# EAGLE design proto (EAGLE 9.6.2)
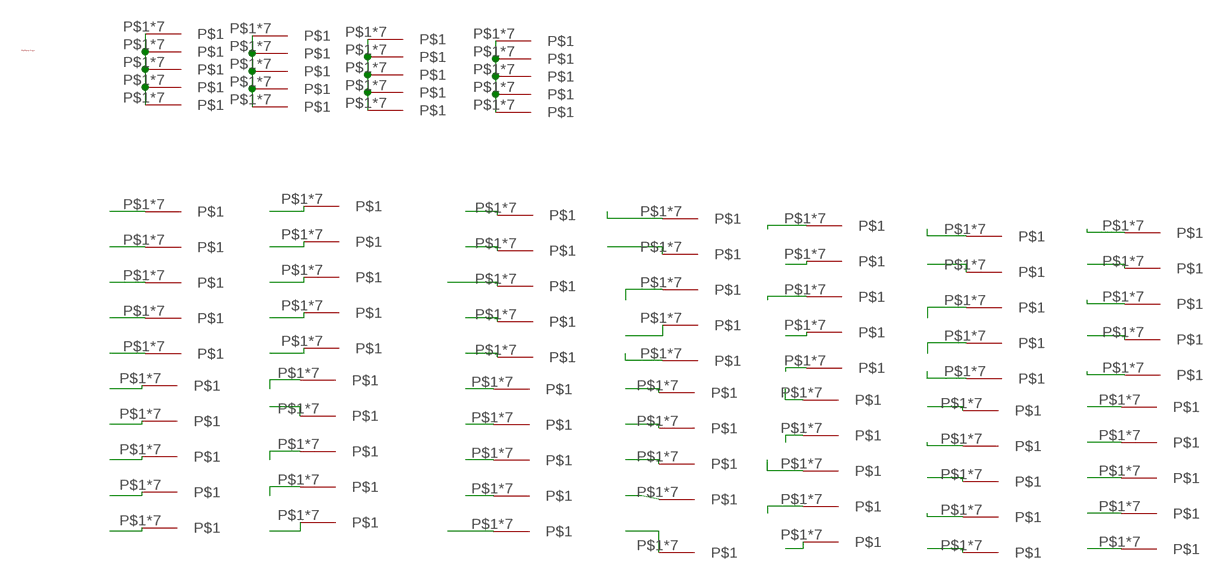
[diagram p0: schematic, sheet 1]

## Parts
U$1  LOGO_HACKHEIM  [LOGO_HACKHEIM]
U$4  PROTO_PAD  [PROTO_PAD]
U$5  PROTO_PAD  [PROTO_PAD]
U$6  PROTO_PAD  [PROTO_PAD]
U$7  PROTO_PAD  [PROTO_PAD]
U$8  PROTO_PAD  [PROTO_PAD]
U$9  PROTO_PAD  [PROTO_PAD]
U$10  PROTO_PAD  [PROTO_PAD]
U$11  PROTO_PAD  [PROTO_PAD]
U$12  PROTO_PAD  [PROTO_PAD]
U$13  PROTO_PAD  [PROTO_PAD]
U$14  PROTO_PAD  [PROTO_PAD]
U$15  PROTO_PAD  [PROTO_PAD]
U$16  PROTO_PAD  [PROTO_PAD]
U$17  PROTO_PAD  [PROTO_PAD]
U$18  PROTO_PAD  [PROTO_PAD]
U$19  PROTO_PAD  [PROTO_PAD]
U$20  PROTO_PAD  [PROTO_PAD]
U$21  PROTO_PAD  [PROTO_PAD]
U$22  PROTO_PAD  [PROTO_PAD]
U$23  PROTO_PAD  [PROTO_PAD]
U$24  PROTO_PAD  [PROTO_PAD]
U$25  PROTO_PAD  [PROTO_PAD]
U$26  PROTO_PAD  [PROTO_PAD]
U$27  PROTO_PAD  [PROTO_PAD]
U$28  PROTO_PAD  [PROTO_PAD]
U$29  PROTO_PAD  [PROTO_PAD]
U$30  PROTO_PAD  [PROTO_PAD]
U$31  PROTO_PAD  [PROTO_PAD]
U$32  PROTO_PAD  [PROTO_PAD]
U$33  PROTO_PAD  [PROTO_PAD]
U$34  PROTO_PAD  [PROTO_PAD]
U$35  PROTO_PAD  [PROTO_PAD]
U$36  PROTO_PAD  [PROTO_PAD]
U$37  PROTO_PAD  [PROTO_PAD]
U$38  PROTO_PAD  [PROTO_PAD]
U$39  PROTO_PAD  [PROTO_PAD]
U$40  PROTO_PAD  [PROTO_PAD]
U$41  PROTO_PAD  [PROTO_PAD]
U$42  PROTO_PAD  [PROTO_PAD]
U$43  PROTO_PAD  [PROTO_PAD]
U$44  PROTO_PAD  [PROTO_PAD]
U$45  PROTO_PAD  [PROTO_PAD]
U$46  PROTO_PAD  [PROTO_PAD]
U$47  PROTO_PAD  [PROTO_PAD]
U$48  PROTO_PAD  [PROTO_PAD]
U$49  PROTO_PAD  [PROTO_PAD]
U$50  PROTO_PAD  [PROTO_PAD]
U$51  PROTO_PAD  [PROTO_PAD]
U$52  PROTO_PAD  [PROTO_PAD]
U$53  PROTO_PAD  [PROTO_PAD]
U$54  PROTO_PAD  [PROTO_PAD]
U$55  PROTO_PAD  [PROTO_PAD]
U$56  PROTO_PAD  [PROTO_PAD]
U$57  PROTO_PAD  [PROTO_PAD]
U$58  PROTO_PAD  [PROTO_PAD]
U$59  PROTO_PAD  [PROTO_PAD]
U$60  PROTO_PAD  [PROTO_PAD]
U$61  PROTO_PAD  [PROTO_PAD]
U$62  PROTO_PAD  [PROTO_PAD]
U$63  PROTO_PAD  [PROTO_PAD]
U$64  PROTO_PAD  [PROTO_PAD]
U$65  PROTO_PAD  [PROTO_PAD]
U$66  PROTO_PAD  [PROTO_PAD]
U$67  PROTO_PAD  [PROTO_PAD]
U$68  PROTO_PAD  [PROTO_PAD]
U$69  PROTO_PAD  [PROTO_PAD]
U$70  PROTO_PAD  [PROTO_PAD]
U$71  PROTO_PAD  [PROTO_PAD]
U$72  PROTO_PAD  [PROTO_PAD]
U$73  PROTO_PAD  [PROTO_PAD]
U$74  PROTO_PAD  [PROTO_PAD]
U$75  PROTO_PAD  [PROTO_PAD]
U$76  PROTO_PAD  [PROTO_PAD]
U$77  PROTO_PAD  [PROTO_PAD]
U$78  PROTO_PAD  [PROTO_PAD]
U$79  PROTO_PAD  [PROTO_PAD]
U$80  PROTO_PAD  [PROTO_PAD]
U$81  PROTO_PAD  [PROTO_PAD]
U$82  PROTO_PAD  [PROTO_PAD]
U$83  PROTO_PAD  [PROTO_PAD]
U$84  PROTO_PAD  [PROTO_PAD]
U$85  PROTO_PAD  [PROTO_PAD]
U$86  PROTO_PAD  [PROTO_PAD]
U$87  PROTO_PAD  [PROTO_PAD]
U$88  PROTO_PAD  [PROTO_PAD]
U$89  PROTO_PAD  [PROTO_PAD]
U$90  PROTO_PAD  [PROTO_PAD]
U$91  PROTO_PAD  [PROTO_PAD]
U$92  PROTO_PAD  [PROTO_PAD]
U$93  PROTO_PAD  [PROTO_PAD]

## Nets
N$1: U$4.P$1 U$4.P$2 U$4.P$3 U$4.P$4 U$4.P$5 U$4.P$6 U$4.P$7 U$5.P$1 U$5.P$2 U$5.P$3 U$5.P$4 U$5.P$5 U$5.P$6 U$5.P$7 U$6.P$1 U$6.P$2 U$6.P$3 U$6.P$4 U$6.P$5 U$6.P$6 U$6.P$7 U$7.P$1 U$7.P$2 U$7.P$3 U$7.P$4 U$7.P$5 U$7.P$6 U$7.P$7 U$8.P$1 U$8.P$2 U$8.P$3 U$8.P$4 U$8.P$5 U$8.P$6 U$8.P$7
N$2: U$9.P$1 U$9.P$2 U$9.P$3 U$9.P$4 U$9.P$5 U$9.P$6 U$9.P$7 U$10.P$1 U$10.P$2 U$10.P$3 U$10.P$4 U$10.P$5 U$10.P$6 U$10.P$7 U$11.P$1 U$11.P$2 U$11.P$3 U$11.P$4 U$11.P$5 U$11.P$6 U$11.P$7 U$12.P$1 U$12.P$2 U$12.P$3 U$12.P$4 U$12.P$5 U$12.P$6 U$12.P$7 U$13.P$1 U$13.P$2 U$13.P$3 U$13.P$4 U$13.P$5 U$13.P$6 U$13.P$7
N$3: U$14.P$1 U$14.P$2 U$14.P$3 U$14.P$4 U$14.P$5 U$14.P$6 U$14.P$7
N$4: U$15.P$1 U$15.P$2 U$15.P$3 U$15.P$4 U$15.P$5 U$15.P$6 U$15.P$7
N$5: U$24.P$1 U$24.P$2 U$24.P$3 U$24.P$4 U$24.P$5 U$24.P$6 U$24.P$7 U$25.P$1 U$25.P$2 U$25.P$3 U$25.P$4 U$25.P$5 U$25.P$6 U$25.P$7 U$26.P$1 U$26.P$2 U$26.P$3 U$26.P$4 U$26.P$5 U$26.P$6 U$26.P$7 U$27.P$1 U$27.P$2 U$27.P$3 U$27.P$4 U$27.P$5 U$27.P$6 U$27.P$7 U$28.P$1 U$28.P$2 U$28.P$3 U$28.P$4 U$28.P$5 U$28.P$6 U$28.P$7
N$6: U$29.P$1 U$29.P$2 U$29.P$3 U$29.P$4 U$29.P$5 U$29.P$6 U$29.P$7 U$30.P$1 U$30.P$2 U$30.P$3 U$30.P$4 U$30.P$5 U$30.P$6 U$30.P$7 U$31.P$1 U$31.P$2 U$31.P$3 U$31.P$4 U$31.P$5 U$31.P$6 U$31.P$7 U$32.P$1 U$32.P$2 U$32.P$3 U$32.P$4 U$32.P$5 U$32.P$6 U$32.P$7 U$33.P$1 U$33.P$2 U$33.P$3 U$33.P$4 U$33.P$5 U$33.P$6 U$33.P$7
N$7: U$16.P$1 U$16.P$2 U$16.P$3 U$16.P$4 U$16.P$5 U$16.P$6 U$16.P$7
N$8: U$17.P$1 U$17.P$2 U$17.P$3 U$17.P$4 U$17.P$5 U$17.P$6 U$17.P$7
N$9: U$18.P$1 U$18.P$2 U$18.P$3 U$18.P$4 U$18.P$5 U$18.P$6 U$18.P$7
N$10: U$44.P$1 U$44.P$2 U$44.P$3 U$44.P$4 U$44.P$5 U$44.P$6 U$44.P$7
N$11: U$45.P$1 U$45.P$2 U$45.P$3 U$45.P$4 U$45.P$5 U$45.P$6 U$45.P$7
N$12: U$46.P$1 U$46.P$2 U$46.P$3 U$46.P$4 U$46.P$5 U$46.P$6 U$46.P$7
N$13: U$47.P$1 U$47.P$2 U$47.P$3 U$47.P$4 U$47.P$5 U$47.P$6 U$47.P$7
N$14: U$48.P$1 U$48.P$2 U$48.P$3 U$48.P$4 U$48.P$5 U$48.P$6 U$48.P$7
N$15: U$19.P$1 U$19.P$2 U$19.P$3 U$19.P$4 U$19.P$5 U$19.P$6 U$19.P$7
N$16: U$20.P$1 U$20.P$2 U$20.P$3 U$20.P$4 U$20.P$5 U$20.P$6 U$20.P$7
N$17: U$21.P$1 U$21.P$2 U$21.P$3 U$21.P$4 U$21.P$5 U$21.P$6 U$21.P$7
N$18: U$22.P$1 U$22.P$2 U$22.P$3 U$22.P$4 U$22.P$5 U$22.P$6 U$22.P$7
N$19: U$23.P$1 U$23.P$2 U$23.P$3 U$23.P$4 U$23.P$5 U$23.P$6 U$23.P$7
N$20: U$49.P$1 U$49.P$2 U$49.P$3 U$49.P$4 U$49.P$5 U$49.P$6 U$49.P$7
N$21: U$50.P$1 U$50.P$2 U$50.P$3 U$50.P$4 U$50.P$5 U$50.P$6 U$50.P$7
N$22: U$51.P$1 U$51.P$2 U$51.P$3 U$51.P$4 U$51.P$5 U$51.P$6 U$51.P$7
N$23: U$52.P$1 U$52.P$2 U$52.P$3 U$52.P$4 U$52.P$5 U$52.P$6 U$52.P$7
N$24: U$34.P$1 U$34.P$2 U$34.P$3 U$34.P$4 U$34.P$5 U$34.P$6 U$34.P$7
N$25: U$35.P$1 U$35.P$2 U$35.P$3 U$35.P$4 U$35.P$5 U$35.P$6 U$35.P$7
N$26: U$36.P$1 U$36.P$2 U$36.P$3 U$36.P$4 U$36.P$5 U$36.P$6 U$36.P$7
N$27: U$37.P$1 U$37.P$2 U$37.P$3 U$37.P$4 U$37.P$5 U$37.P$6 U$37.P$7
N$28: U$38.P$1 U$38.P$2 U$38.P$3 U$38.P$4 U$38.P$5 U$38.P$6 U$38.P$7
N$29: U$54.P$1 U$54.P$2 U$54.P$3 U$54.P$4 U$54.P$5 U$54.P$6 U$54.P$7
N$30: U$55.P$1 U$55.P$2 U$55.P$3 U$55.P$4 U$55.P$5 U$55.P$6 U$55.P$7
N$31: U$56.P$1 U$56.P$2 U$56.P$3 U$56.P$4 U$56.P$5 U$56.P$6 U$56.P$7
N$32: U$57.P$1 U$57.P$2 U$57.P$3 U$57.P$4 U$57.P$5 U$57.P$6 U$57.P$7
N$33: U$58.P$1 U$58.P$2 U$58.P$3 U$58.P$4 U$58.P$5 U$58.P$6 U$58.P$7
N$34: U$39.P$1 U$39.P$2 U$39.P$3 U$39.P$4 U$39.P$5 U$39.P$6 U$39.P$7
N$35: U$40.P$1 U$40.P$2 U$40.P$3 U$40.P$4 U$40.P$5 U$40.P$6 U$40.P$7
N$36: U$41.P$1 U$41.P$2 U$41.P$3 U$41.P$4 U$41.P$5 U$41.P$6 U$41.P$7
N$37: U$42.P$1 U$42.P$2 U$42.P$3 U$42.P$4 U$42.P$5 U$42.P$6 U$42.P$7
N$38: U$43.P$1 U$43.P$2 U$43.P$3 U$43.P$4 U$43.P$5 U$43.P$6 U$43.P$7
N$39: U$59.P$1 U$59.P$2 U$59.P$3 U$59.P$4 U$59.P$5 U$59.P$6 U$59.P$7
N$40: U$60.P$1 U$60.P$2 U$60.P$3 U$60.P$4 U$60.P$5 U$60.P$6 U$60.P$7
N$41: U$61.P$1 U$61.P$2 U$61.P$3 U$61.P$4 U$61.P$5 U$61.P$6 U$61.P$7
N$42: U$62.P$1 U$62.P$2 U$62.P$3 U$62.P$4 U$62.P$5 U$62.P$6 U$62.P$7
N$43: U$63.P$1 U$63.P$2 U$63.P$3 U$63.P$4 U$63.P$5 U$63.P$6 U$63.P$7
N$44: U$64.P$1 U$64.P$2 U$64.P$3 U$64.P$4 U$64.P$5 U$64.P$6 U$64.P$7
N$45: U$65.P$1 U$65.P$2 U$65.P$3 U$65.P$4 U$65.P$5 U$65.P$6 U$65.P$7
N$46: U$66.P$1 U$66.P$2 U$66.P$3 U$66.P$4 U$66.P$5 U$66.P$6 U$66.P$7
N$47: U$67.P$1 U$67.P$2 U$67.P$3 U$67.P$4 U$67.P$5 U$67.P$6 U$67.P$7
N$48: U$68.P$1 U$68.P$2 U$68.P$3 U$68.P$4 U$68.P$5 U$68.P$6 U$68.P$7
N$49: U$69.P$1 U$69.P$2 U$69.P$3 U$69.P$4 U$69.P$5 U$69.P$6 U$69.P$7
N$50: U$70.P$1 U$70.P$2 U$70.P$3 U$70.P$4 U$70.P$5 U$70.P$6 U$70.P$7
N$51: U$71.P$1 U$71.P$2 U$71.P$3 U$71.P$4 U$71.P$5 U$71.P$6 U$71.P$7
N$52: U$72.P$1 U$72.P$2 U$72.P$3 U$72.P$4 U$72.P$5 U$72.P$6 U$72.P$7
N$53: U$73.P$1 U$73.P$2 U$73.P$3 U$73.P$4 U$73.P$5 U$73.P$6 U$73.P$7
N$54: U$74.P$1 U$74.P$2 U$74.P$3 U$74.P$4 U$74.P$5 U$74.P$6 U$74.P$7
N$55: U$75.P$1 U$75.P$2 U$75.P$3 U$75.P$4 U$75.P$5 U$75.P$6 U$75.P$7
N$56: U$76.P$1 U$76.P$2 U$76.P$3 U$76.P$4 U$76.P$5 U$76.P$6 U$76.P$7
N$57: U$77.P$1 U$77.P$2 U$77.P$3 U$77.P$4 U$77.P$5 U$77.P$6 U$77.P$7
N$58: U$78.P$1 U$78.P$2 U$78.P$3 U$78.P$4 U$78.P$5 U$78.P$6 U$78.P$7
N$59: U$79.P$1 U$79.P$2 U$79.P$3 U$79.P$4 U$79.P$5 U$79.P$6 U$79.P$7
N$60: U$80.P$1 U$80.P$2 U$80.P$3 U$80.P$4 U$80.P$5 U$80.P$6 U$80.P$7
N$61: U$81.P$1 U$81.P$2 U$81.P$3 U$81.P$4 U$81.P$5 U$81.P$6 U$81.P$7
N$62: U$82.P$1 U$82.P$2 U$82.P$3 U$82.P$4 U$82.P$5 U$82.P$6 U$82.P$7
N$63: U$83.P$1 U$83.P$2 U$83.P$3 U$83.P$4 U$83.P$5 U$83.P$6 U$83.P$7
N$64: U$84.P$1 U$84.P$2 U$84.P$3 U$84.P$4 U$84.P$5 U$84.P$6 U$84.P$7
N$65: U$85.P$1 U$85.P$2 U$85.P$3 U$85.P$4 U$85.P$5 U$85.P$6 U$85.P$7
N$66: U$86.P$1 U$86.P$2 U$86.P$3 U$86.P$4 U$86.P$5 U$86.P$6 U$86.P$7
N$67: U$87.P$1 U$87.P$2 U$87.P$3 U$87.P$4 U$87.P$5 U$87.P$6 U$87.P$7
N$68: U$88.P$1 U$88.P$2 U$88.P$3 U$88.P$4 U$88.P$5 U$88.P$6 U$88.P$7
N$69: U$89.P$1 U$89.P$2 U$89.P$3 U$89.P$4 U$89.P$5 U$89.P$6 U$89.P$7
N$70: U$90.P$1 U$90.P$2 U$90.P$3 U$90.P$4 U$90.P$5 U$90.P$6 U$90.P$7
N$71: U$91.P$1 U$91.P$2 U$91.P$3 U$91.P$4 U$91.P$5 U$91.P$6 U$91.P$7
N$72: U$92.P$1 U$92.P$2 U$92.P$3 U$92.P$4 U$92.P$5 U$92.P$6 U$92.P$7
N$73: U$93.P$1 U$93.P$2 U$93.P$3 U$93.P$4 U$93.P$5 U$93.P$6 U$93.P$7
N$74: U$53.P$1 U$53.P$2 U$53.P$3 U$53.P$4 U$53.P$5 U$53.P$6 U$53.P$7

## Library data of the parts
U$1 = TimeExpander2:LOGO_HACKHEIM
U$4-U$93 = TimeExpander2:PROTO_PAD

## Board
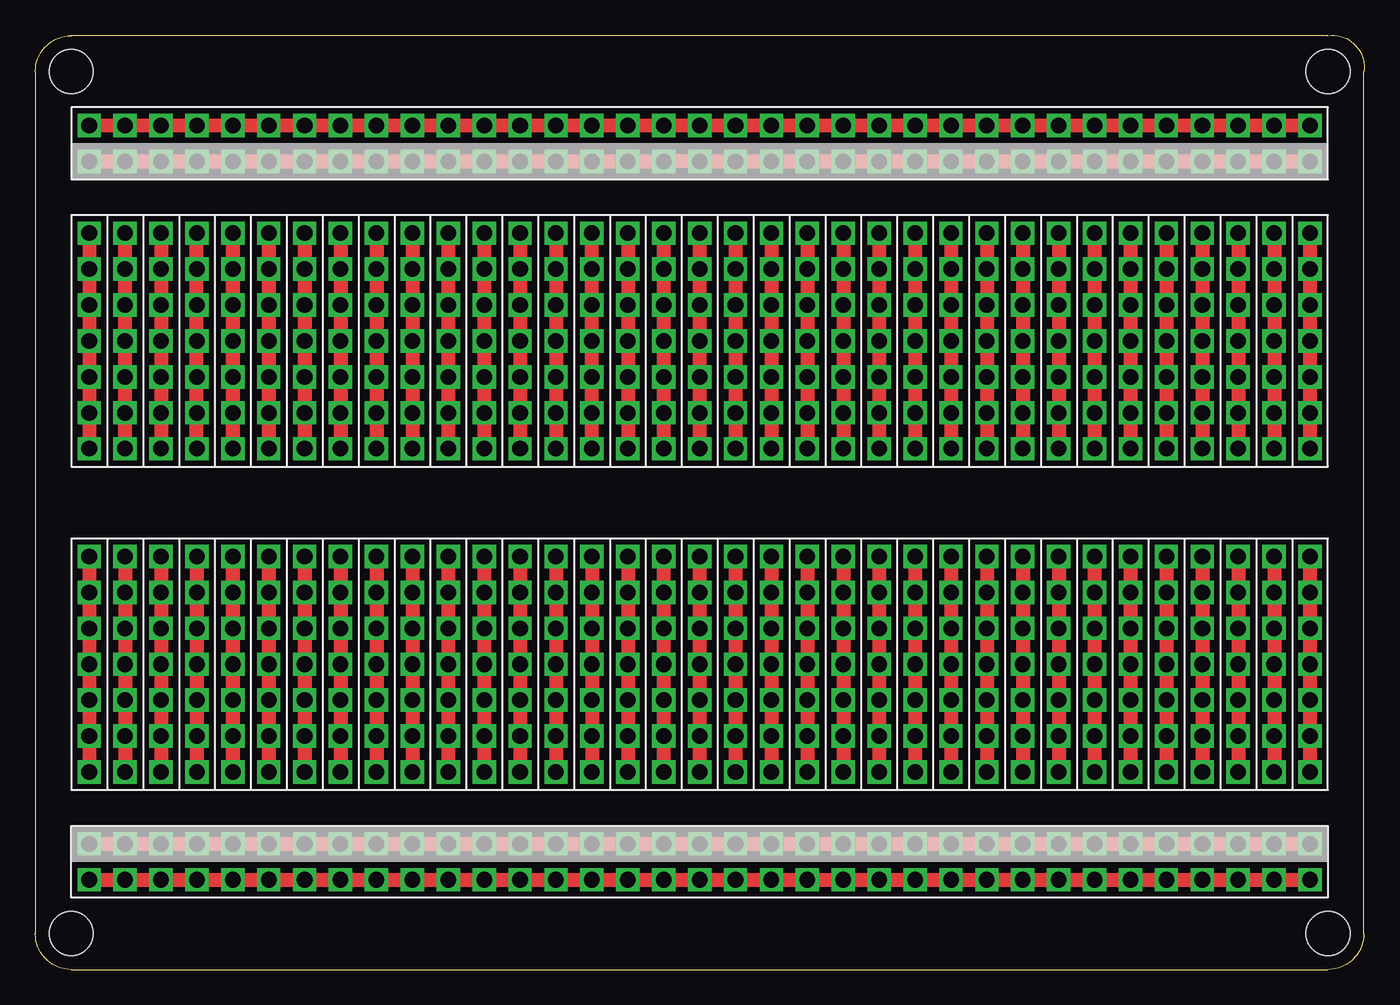
[diagram p1: board, top side]
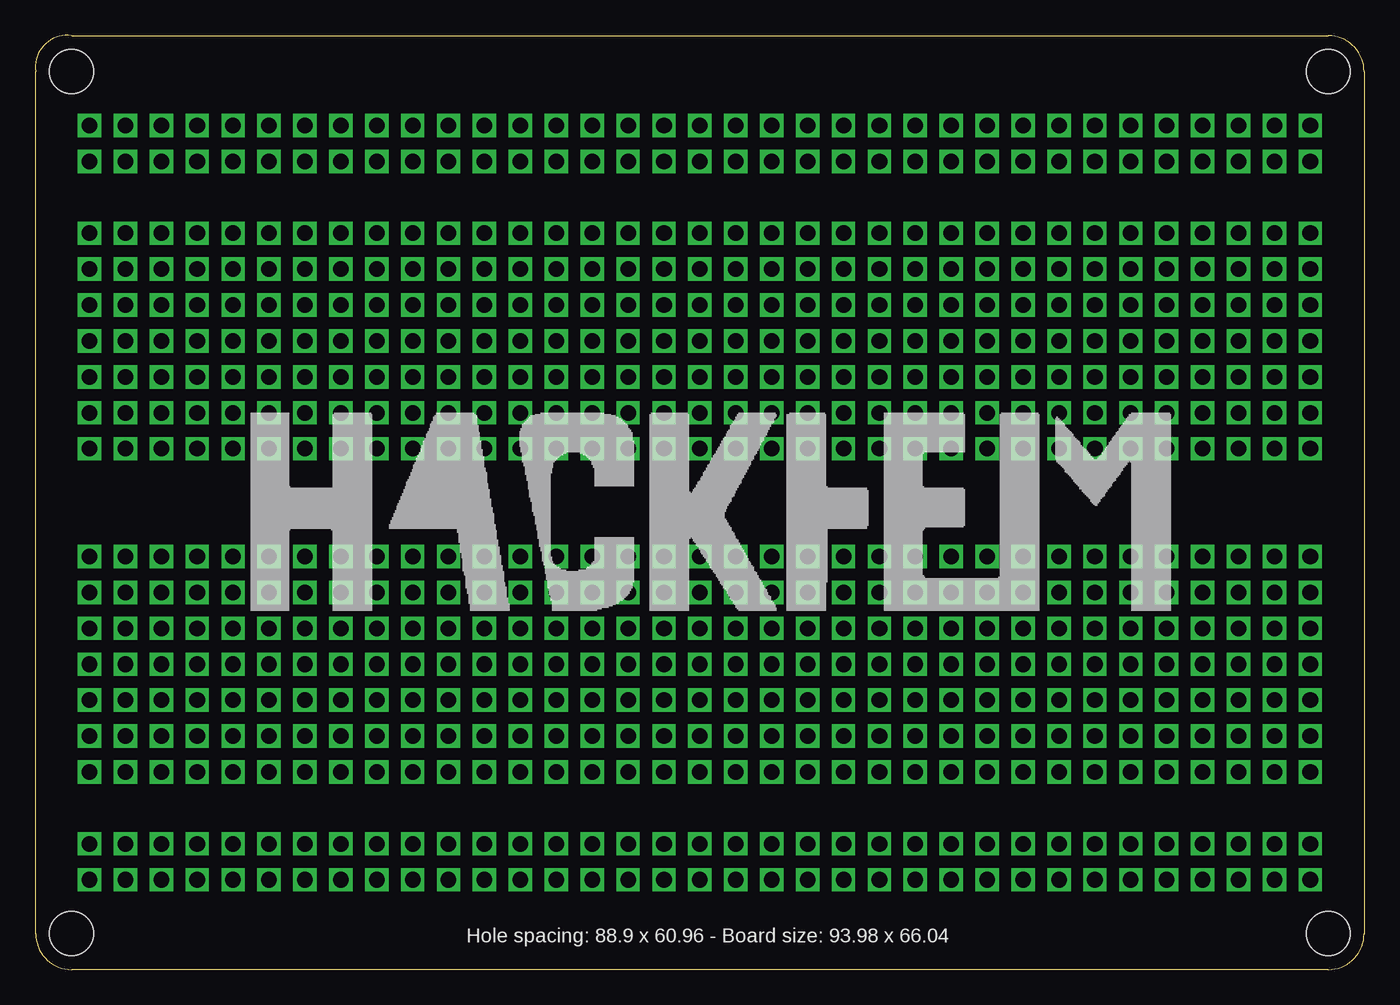
[diagram p2: board, bottom side, seen from below]

Size 94 x 66.06 mm. Coordinates in mm from the lower left corner, seen from the top.
Outline: 2.54,0 91.44,0 arc90 93.98,2.54 93.98,63.5 arc106 91.44,66.04 2.54,66.04 arc90 0,63.5 0,2.54 arc90 2.54,0
Copper layers (1*16): Top 0.035mm / dielectric 1.5mm / Bottom 0.035mm
Design rules "default": minimum track width 6mil, minimum drill 0.35mm, track to track 6mil, track to pad 6mil, pad to pad 6mil, via to via 6mil, smd to smd 6mil, copper to edge 40mil, drill to drill 6mil, minimum pad ring 10mil, minimum via ring 8mil, stop-mask expansion 4mil, vias tented up to drill 0mil, thermal gap 10mil
Holes 3.1 mm at 2.54,63.5 91.44,63.5 91.44,2.54 2.54,2.54

### Footprints (pad centres in the part's own frame; a part is rotated, then mirrored left to right if it is on the bottom)
PROTO_PAD = drill 1.1 square: P$1 0,0; P$2 2.54,0; P$3 5.08,0; P$4 7.62,0; P$5 10.16,0; P$6 12.7,0; P$7 15.24,0

### Placement (x,y rotation side)
U$1  80.01,24.13 0 bottom
U$4  3.81,6.35 0 top
U$5  21.59,6.35 0 top
U$6  39.37,6.35 0 top
U$7  57.15,6.35 0 top
U$8  74.93,6.35 0 top
U$9  3.81,8.89 0 top
U$10  21.59,8.89 0 top
U$11  39.37,8.89 0 top
U$12  57.15,8.89 0 top
U$13  74.93,8.89 0 top
U$14  3.81,29.21 270 top
U$15  3.81,36.83 90 top
U$16  6.35,36.83 90 top
U$17  8.89,36.83 90 top
U$18  11.43,36.83 90 top
U$19  13.97,36.83 90 top
U$20  16.51,36.83 90 top
U$21  19.05,36.83 90 top
U$22  21.59,36.83 90 top
U$23  24.13,36.83 90 top
U$24  3.81,57.15 0 top
U$25  21.59,57.15 0 top
U$26  39.37,57.15 0 top
U$27  57.15,57.15 0 top
U$28  74.93,57.15 0 top
U$29  3.81,59.69 0 top
U$30  21.59,59.69 0 top
U$31  39.37,59.69 0 top
U$32  57.15,59.69 0 top
U$33  74.93,59.69 0 top
U$34  26.67,36.83 90 top
U$35  29.21,36.83 90 top
U$36  31.75,36.83 90 top
U$37  34.29,36.83 90 top
U$38  36.83,36.83 90 top
U$39  39.37,36.83 90 top
U$40  41.91,36.83 90 top
U$41  44.45,36.83 90 top
U$42  46.99,36.83 90 top
U$43  49.53,36.83 90 top
U$44  52.07,36.83 90 top
U$45  54.61,36.83 90 top
U$46  57.15,36.83 90 top
U$47  59.69,36.83 90 top
U$48  62.23,36.83 90 top
U$49  64.77,36.83 90 top
U$50  67.31,36.83 90 top
U$51  69.85,36.83 90 top
U$52  72.39,36.83 90 top
U$53  74.93,36.83 90 top
U$54  77.47,36.83 90 top
U$55  80.01,36.83 90 top
U$56  82.55,36.83 90 top
U$57  85.09,36.83 90 top
U$58  87.63,36.83 90 top
U$59  90.17,36.83 90 top
U$60  6.35,29.21 270 top
U$61  8.89,29.21 270 top
U$62  11.43,29.21 270 top
U$63  13.97,29.21 270 top
U$64  16.51,29.21 270 top
U$65  19.05,29.21 270 top
U$66  21.59,29.21 270 top
U$67  24.13,29.21 270 top
U$68  26.67,29.21 270 top
U$69  29.21,29.21 270 top
U$70  31.75,29.21 270 top
U$71  34.29,29.21 270 top
U$72  36.83,29.21 270 top
U$73  39.37,29.21 270 top
U$74  41.91,29.21 270 top
U$75  44.45,29.21 270 top
U$76  46.99,29.21 270 top
U$77  49.53,29.21 270 top
U$78  52.07,29.21 270 top
U$79  54.61,29.21 270 top
U$80  57.15,29.21 270 top
U$81  59.69,29.21 270 top
U$82  62.23,29.21 270 top
U$83  64.77,29.21 270 top
U$84  67.31,29.21 270 top
U$85  69.85,29.21 270 top
U$86  72.39,29.21 270 top
U$87  74.93,29.21 270 top
U$88  77.47,29.21 270 top
U$89  80.01,29.21 270 top
U$90  82.55,29.21 270 top
U$91  85.09,29.21 270 top
U$92  87.63,29.21 270 top
U$93  90.17,29.21 270 top

### Tracks (layer width: path | path; a pad name or v marks a point on that pad's centre or on a via)
N$1
  Top 1: U$4.P$1 U$4.P$2 U$4.P$3 U$4.P$4 U$4.P$5 U$4.P$6 U$4.P$7 U$5.P$1 U$5.P$2 U$5.P$3 U$5.P$4 U$5.P$5 U$5.P$6 U$5.P$7 U$6.P$1 U$6.P$2 U$6.P$3 U$6.P$4 U$6.P$5 U$6.P$6 U$6.P$7 U$7.P$1 U$7.P$2 U$7.P$3 U$7.P$4 U$7.P$5 U$7.P$6 U$7.P$7 U$8.P$1 U$8.P$2 U$8.P$3 U$8.P$4 U$8.P$5 U$8.P$6 U$8.P$7
N$2
  Top 1: U$9.P$1 U$9.P$2 U$9.P$3 U$9.P$4 U$9.P$5 U$9.P$6 U$9.P$7 U$10.P$1 U$10.P$2 U$10.P$3 U$10.P$4 U$10.P$5 U$10.P$6 U$10.P$7 U$11.P$1 U$11.P$2 U$11.P$3 U$11.P$4 U$11.P$5 U$11.P$6 U$11.P$7 U$12.P$1 U$12.P$2 U$12.P$3 U$12.P$4 U$12.P$5 U$12.P$6 U$12.P$7 U$13.P$1 U$13.P$2 U$13.P$3 U$13.P$4 U$13.P$5 U$13.P$6 U$13.P$7
N$3
  Top 1: U$14.P$1 U$14.P$2 U$14.P$3 U$14.P$4 U$14.P$5 U$14.P$6 U$14.P$7
N$4
  Top 1: U$15.P$7 U$15.P$6 U$15.P$5 U$15.P$4 U$15.P$3 U$15.P$2 U$15.P$1
N$5
  Top 1: U$24.P$1 U$24.P$2 U$24.P$3 U$24.P$4 U$24.P$5 U$24.P$6 U$24.P$7 U$25.P$1 U$25.P$2 U$25.P$3 U$25.P$4 U$25.P$5 U$25.P$6 U$25.P$7 U$26.P$1 U$26.P$2 U$26.P$3 U$26.P$4 U$26.P$5 U$26.P$6 U$26.P$7 U$27.P$1 U$27.P$2 U$27.P$3 U$27.P$4 U$27.P$5 U$27.P$6 U$27.P$7 U$28.P$1 U$28.P$2 U$28.P$3 U$28.P$4 U$28.P$5 U$28.P$6 U$28.P$7
N$6
  Top 1: U$29.P$1 U$29.P$2 U$29.P$3 U$29.P$4 U$29.P$5 U$29.P$6 U$29.P$7 U$30.P$1 U$30.P$2 U$30.P$3 U$30.P$4 U$30.P$5 U$30.P$6 U$30.P$7 U$31.P$1 U$31.P$2 U$31.P$3 U$31.P$4 U$31.P$5 U$31.P$6 U$31.P$7 U$32.P$1 U$32.P$2 U$32.P$3 U$32.P$4 U$32.P$5 U$32.P$6 U$32.P$7 U$33.P$1 U$33.P$2 U$33.P$3 U$33.P$4 U$33.P$5 U$33.P$6 U$33.P$7
N$7
  Top 1: U$16.P$1 U$16.P$2 U$16.P$3 U$16.P$4 U$16.P$5 U$16.P$6 U$16.P$7
N$8
  Top 1: U$17.P$7 U$17.P$6 U$17.P$5 U$17.P$4 U$17.P$3 U$17.P$2 U$17.P$1
N$9
  Top 1: U$18.P$1 U$18.P$2 U$18.P$3 U$18.P$4 U$18.P$5 U$18.P$6 U$18.P$7
N$10
  Top 1: U$44.P$7 U$44.P$6 U$44.P$5 U$44.P$4 U$44.P$3 U$44.P$2 U$44.P$1
N$11
  Top 1: U$45.P$7 U$45.P$6 U$45.P$5 U$45.P$4 U$45.P$3 U$45.P$2 U$45.P$1
N$12
  Top 1: U$46.P$7 U$46.P$6 U$46.P$5 U$46.P$4 U$46.P$3 U$46.P$2 U$46.P$1
N$13
  Top 1: U$47.P$7 U$47.P$6 U$47.P$5 U$47.P$4 U$47.P$3 U$47.P$2 U$47.P$1
N$14
  Top 1: U$48.P$7 U$48.P$6 U$48.P$5 U$48.P$4 U$48.P$3 U$48.P$2 U$48.P$1
N$15
  Top 1: U$19.P$7 U$19.P$6 U$19.P$5 U$19.P$4 U$19.P$3 U$19.P$2 U$19.P$1
N$16
  Top 1: U$20.P$7 U$20.P$6 U$20.P$5 U$20.P$4 U$20.P$3 U$20.P$2 U$20.P$1
N$17
  Top 1: U$21.P$7 U$21.P$6 U$21.P$5 U$21.P$4 U$21.P$3 U$21.P$2 U$21.P$1
N$18
  Top 1: U$22.P$7 U$22.P$6 U$22.P$5 U$22.P$4 U$22.P$3 U$22.P$2 U$22.P$1
N$19
  Top 1: U$23.P$7 U$23.P$6 U$23.P$5 U$23.P$4 U$23.P$3 U$23.P$2 U$23.P$1
N$20
  Top 1: U$49.P$7 U$49.P$6 U$49.P$5 U$49.P$4 U$49.P$3 U$49.P$2 U$49.P$1
N$21
  Top 1: U$50.P$7 U$50.P$6 U$50.P$5 U$50.P$4 U$50.P$3 U$50.P$2 U$50.P$1
N$22
  Top 1: U$51.P$7 U$51.P$6 U$51.P$5 U$51.P$4 U$51.P$3 U$51.P$2 U$51.P$1
N$23
  Top 1: U$52.P$7 U$52.P$6 U$52.P$5 U$52.P$4 U$52.P$3 U$52.P$2 U$52.P$1
N$24
  Top 1: U$34.P$7 U$34.P$6 U$34.P$5 U$34.P$4 U$34.P$3 U$34.P$2 U$34.P$1
N$25
  Top 1: U$35.P$7 U$35.P$6 U$35.P$5 U$35.P$4 U$35.P$3 U$35.P$2 U$35.P$1
N$26
  Top 1: U$36.P$7 U$36.P$6 U$36.P$5 U$36.P$4 U$36.P$3 U$36.P$2 U$36.P$1
N$27
  Top 1: U$37.P$7 U$37.P$6 U$37.P$5 U$37.P$4 U$37.P$3 U$37.P$2 U$37.P$1
N$28
  Top 1: U$38.P$7 U$38.P$6 U$38.P$5 U$38.P$4 U$38.P$3 U$38.P$2 U$38.P$1
N$29
  Top 1: U$54.P$7 U$54.P$6 U$54.P$5 U$54.P$4 U$54.P$3 U$54.P$2 U$54.P$1
N$30
  Top 1: U$55.P$7 U$55.P$6 U$55.P$5 U$55.P$4 U$55.P$3 U$55.P$2 U$55.P$1
N$31
  Top 1: U$56.P$7 U$56.P$6 U$56.P$5 U$56.P$4 U$56.P$3 U$56.P$2 U$56.P$1
N$32
  Top 1: U$57.P$7 U$57.P$6 U$57.P$5 U$57.P$4 U$57.P$3 U$57.P$2 U$57.P$1
N$33
  Top 1: U$58.P$7 U$58.P$6 U$58.P$5 U$58.P$4 U$58.P$3 U$58.P$2 U$58.P$1
N$34
  Top 1: U$39.P$1 U$39.P$2 U$39.P$3 U$39.P$4 U$39.P$5 U$39.P$6 U$39.P$7
N$35
  Top 1: U$40.P$7 U$40.P$6 U$40.P$5 U$40.P$4 U$40.P$3 U$40.P$2 U$40.P$1
N$36
  Top 1: U$41.P$7 U$41.P$6 U$41.P$5 U$41.P$4 U$41.P$3 U$41.P$2 U$41.P$1
N$37
  Top 1: U$42.P$7 U$42.P$6 U$42.P$5 U$42.P$4 U$42.P$3 U$42.P$2 U$42.P$1
N$38
  Top 1: U$43.P$7 U$43.P$6 U$43.P$5 U$43.P$4 U$43.P$3 U$43.P$2 U$43.P$1
N$39
  Top 1: U$59.P$7 U$59.P$6 U$59.P$5 U$59.P$4 U$59.P$3 U$59.P$2 U$59.P$1
N$40
  Top 1: U$60.P$1 U$60.P$2 U$60.P$3 U$60.P$4 U$60.P$5 U$60.P$6 U$60.P$7
N$41
  Top 1: U$61.P$1 U$61.P$2 U$61.P$3 U$61.P$4 U$61.P$5 U$61.P$6 U$61.P$7
N$42
  Top 1: U$62.P$1 U$62.P$2 U$62.P$3 U$62.P$4 U$62.P$5 U$62.P$6 U$62.P$7
N$43
  Top 1: U$63.P$1 U$63.P$2 U$63.P$3 U$63.P$4 U$63.P$5 U$63.P$6 U$63.P$7
N$44
  Top 1: U$64.P$1 U$64.P$2 U$64.P$3 U$64.P$4 U$64.P$5 U$64.P$6 U$64.P$7
N$45
  Top 1: U$65.P$1 U$65.P$2 U$65.P$3 U$65.P$4 U$65.P$5 U$65.P$6 U$65.P$7
N$46
  Top 1: U$66.P$1 U$66.P$2 U$66.P$3 U$66.P$4 U$66.P$5 U$66.P$6 U$66.P$7
N$47
  Top 1: U$67.P$1 U$67.P$2 U$67.P$3 U$67.P$4 U$67.P$5 U$67.P$6 U$67.P$7
N$48
  Top 1: U$68.P$1 U$68.P$2 U$68.P$3 U$68.P$4 U$68.P$5 U$68.P$6 U$68.P$7
N$49
  Top 1: U$69.P$1 U$69.P$2 U$69.P$3 U$69.P$4 U$69.P$5 U$69.P$6 U$69.P$7
N$50
  Top 1: U$70.P$1 U$70.P$2 U$70.P$3 U$70.P$4 U$70.P$5 U$70.P$6 U$70.P$7
N$51
  Top 1: U$71.P$1 U$71.P$2 U$71.P$3 U$71.P$4 U$71.P$5 U$71.P$6 U$71.P$7
N$52
  Top 1: U$72.P$1 U$72.P$2 U$72.P$3 U$72.P$4 U$72.P$5 U$72.P$6 U$72.P$7
N$53
  Top 1: U$73.P$1 U$73.P$2 U$73.P$3 U$73.P$4 U$73.P$5 U$73.P$6 U$73.P$7
N$54
  Top 1: U$74.P$1 U$74.P$2 U$74.P$3 U$74.P$4 U$74.P$5 U$74.P$6 U$74.P$7
N$55
  Top 1: U$75.P$1 U$75.P$2 U$75.P$3 U$75.P$4 U$75.P$5 U$75.P$6 U$75.P$7
N$56
  Top 1: U$76.P$1 U$76.P$2 U$76.P$3 U$76.P$4 U$76.P$5 U$76.P$6 U$76.P$7
N$57
  Top 1: U$77.P$1 U$77.P$2 U$77.P$3 U$77.P$4 U$77.P$5 U$77.P$6 U$77.P$7
N$58
  Top 1: U$78.P$1 U$78.P$2 U$78.P$3 U$78.P$4 U$78.P$5 U$78.P$6 U$78.P$7
N$59
  Top 1: U$79.P$1 U$79.P$2 U$79.P$3 U$79.P$4 U$79.P$5 U$79.P$6 U$79.P$7
N$60
  Top 1: U$80.P$1 U$80.P$2 U$80.P$3 U$80.P$4 U$80.P$5 U$80.P$6 U$80.P$7
N$61
  Top 1: U$81.P$1 U$81.P$2 U$81.P$3 U$81.P$4 U$81.P$5 U$81.P$6 U$81.P$7
N$62
  Top 1: U$82.P$1 U$82.P$2 U$82.P$3 U$82.P$4 U$82.P$5 U$82.P$6 U$82.P$7
N$63
  Top 1: U$83.P$1 U$83.P$2 U$83.P$3 U$83.P$4 U$83.P$5 U$83.P$6 U$83.P$7
N$64
  Top 1: U$84.P$1 U$84.P$2 U$84.P$3 U$84.P$4 U$84.P$5 U$84.P$6 U$84.P$7
N$65
  Top 1: U$85.P$1 U$85.P$2 U$85.P$3 U$85.P$4 U$85.P$5 U$85.P$6 U$85.P$7
N$66
  Top 1: U$86.P$1 U$86.P$2 U$86.P$3 U$86.P$4 U$86.P$5 U$86.P$6 U$86.P$7
N$67
  Top 1: U$87.P$1 U$87.P$2 U$87.P$3 U$87.P$4 U$87.P$5 U$87.P$6 U$87.P$7
N$68
  Top 1: U$88.P$1 U$88.P$2 U$88.P$3 U$88.P$4 U$88.P$5 U$88.P$6 U$88.P$7
N$69
  Top 1: U$89.P$1 U$89.P$2 U$89.P$3 U$89.P$4 U$89.P$5 U$89.P$6 U$89.P$7
N$70
  Top 1: U$90.P$1 U$90.P$2 U$90.P$3 U$90.P$4 U$90.P$5 U$90.P$6 U$90.P$7
N$71
  Top 1: U$91.P$1 U$91.P$2 U$91.P$3 U$91.P$4 U$91.P$5 U$91.P$6 U$91.P$7
N$72
  Top 1: U$92.P$1 U$92.P$2 U$92.P$3 U$92.P$4 U$92.P$5 U$92.P$6 U$92.P$7
N$73
  Top 1: U$93.P$1 U$93.P$2 U$93.P$3 U$93.P$4 U$93.P$5 U$93.P$6 U$93.P$7
N$74
  Top 1: U$53.P$7 U$53.P$6 U$53.P$5 U$53.P$4 U$53.P$3 U$53.P$2 U$53.P$1

### Text on the board
bPlace: Hole spacing: 88.9 x 60.96 - Board size: 93.98 x 66.04